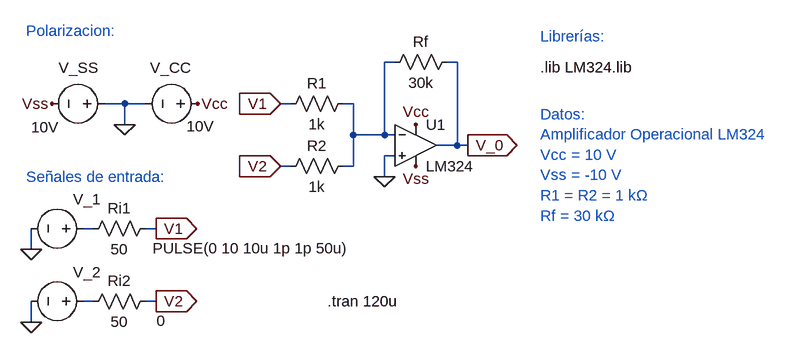
[diagram p0: schematic Lab_2_Circ_1_Ri=50+SlewRate.asc]
Lab_2_Circ_1_Ri=50+SlewRate.asc, the LTspice schematic file:
Version 4
SHEET 1 1560 680
WIRE 448 -320 432 -320
WIRE 544 -320 528 -320
WIRE 32 -256 0 -256
WIRE 64 -256 32 -256
WIRE 288 -256 272 -256
WIRE 384 -256 368 -256
WIRE 32 -224 32 -256
WIRE 384 -208 384 -256
WIRE 432 -208 432 -320
WIRE 432 -208 384 -208
WIRE 448 -208 432 -208
WIRE 544 -192 544 -320
WIRE 544 -192 512 -192
WIRE 560 -192 544 -192
WIRE 448 -176 432 -176
WIRE 288 -160 272 -160
WIRE 384 -160 384 -208
WIRE 384 -160 368 -160
WIRE 432 -144 432 -176
WIRE -16 -64 -32 -64
WIRE 80 -64 64 -64
WIRE -112 -32 -112 -64
WIRE -16 48 -32 48
WIRE 80 48 64 48
WIRE -112 80 -112 48
FLAG 432 -144 0
FLAG 144 -256 Vcc
FLAG 480 -224 Vcc
FLAG -80 -256 Vss
FLAG 480 -160 Vss
FLAG 32 -224 0
FLAG -112 -32 0
FLAG 272 -256 V1
IOPIN 272 -256 In
FLAG 80 -64 V1
IOPIN 80 -64 Out
FLAG 272 -160 V2
IOPIN 272 -160 In
FLAG 560 -192 V_0
IOPIN 560 -192 Out
FLAG -112 80 0
FLAG 80 48 V2
IOPIN 80 48 Out
SYMBOL OpAmps\\opamp2 480 -256 R0
SYMATTR InstName U1
SYMATTR Value LM324
SYMBOL res -32 -48 R270
WINDOW 0 32 56 VTop 2
WINDOW 3 0 56 VBottom 2
SYMATTR InstName Ri1
SYMATTR Value 50
SYMBOL voltage -16 -64 M270
WINDOW 0 45 31 VLeft 2
WINDOW 3 -30 -91 VLeft 2
WINDOW 123 -1 -51 VLeft 2
WINDOW 39 0 0 Left 0
SYMATTR InstName V_1
SYMATTR Value PULSE(0 10 10u 1p 1p 50u)
SYMBOL voltage 160 -256 R90
WINDOW 0 -55 25 VRight 2
WINDOW 3 35 -10 VRight 2
WINDOW 123 0 0 Left 0
WINDOW 39 0 0 Left 0
SYMATTR InstName V_CC
SYMATTR Value 10V
SYMBOL voltage 16 -256 R90
WINDOW 0 -55 25 VRight 2
WINDOW 3 36 85 VRight 2
WINDOW 123 0 0 Left 0
WINDOW 39 0 0 Left 0
SYMATTR InstName V_SS
SYMATTR Value 10V
SYMBOL res -32 64 R270
WINDOW 0 32 56 VTop 2
WINDOW 3 0 56 VBottom 2
SYMATTR InstName Ri2
SYMATTR Value 50
SYMBOL voltage -16 48 M270
WINDOW 0 45 31 VLeft 2
WINDOW 3 -30 -97 VLeft 2
WINDOW 123 0 0 Left 0
WINDOW 39 0 0 Left 0
SYMATTR InstName V_2
SYMATTR Value 0
SYMBOL res 384 -272 R90
WINDOW 0 0 56 VBottom 2
WINDOW 3 32 56 VTop 2
SYMATTR InstName R1
SYMATTR Value 1k
SYMBOL res 384 -176 R90
WINDOW 0 0 56 VBottom 2
WINDOW 3 32 56 VTop 2
SYMATTR InstName R2
SYMATTR Value 1k
SYMBOL res 544 -336 R90
WINDOW 0 0 56 VBottom 2
WINDOW 3 32 56 VTop 2
SYMATTR InstName Rf
SYMATTR Value 30k
TEXT 672 -312 Left 2 !.lib LM324.lib
TEXT 672 -360 Left 2 ;Librerías:
TEXT -120 -368 Left 2 ;Polarizacion:
TEXT -120 -144 Left 2 ;Señales de entrada:
TEXT 672 -240 Left 2 ;Datos:\nAmplificador Operacional LM324\nVcc = 10 V\nVss = -10 V\nR1 = R2 = 1 kΩ\nRf = 30 kΩ
TEXT 344 48 Left 2 !.tran 120u

The netlist it stands for:
* Lab_2_Circ_1_Ri=50+SlewRate.asc
XU1 0 N001 Vcc Vss V_0 LM324  ; pins In+ In- V+ V- OUT
Ri1 N002 V1 50
V_1 N002 0 PULSE(0 10 10u 1p 1p 50u)
V_CC Vcc 0 10V
V_SS 0 Vss 10V
Ri2 N003 V2 50
V_2 N003 0 0
R1 N001 V1 1k
R2 N001 V2 1k
Rf V_0 N001 30k
.lib LM324.lib
* Librerías:
* Polarizacion:
* Señales de entrada:
* Datos:
* Amplificador Operacional LM324
* Vcc = 10 V
* Vss = -10 V
* R1 = R2 = 1 kΩ
* Rf = 30 kΩ
.tran 120u
.backanno
.end